# Altium schematic sheet MIDI.SchDoc
size A4; SheetNumber: 2; SheetTotal: 3
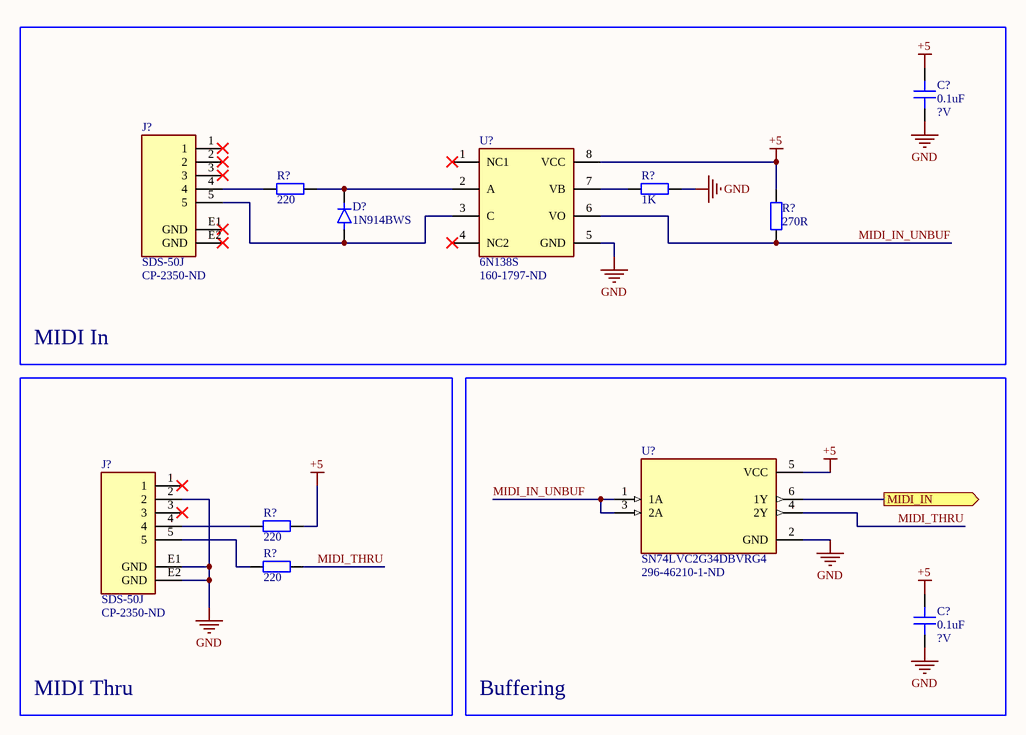
[diagram p0: MIDI.SchDoc]

## Parts
(Parts that share a designator on the sheet are numbered #1, #2 ... from top to bottom, then left to right.)
C?#1  value 0.1uF  Voltage: ?V  [CAP 0402/1005]  (hidden comment: Capacitor_SMD)
C?#2  value 0.1uF  Voltage: ?V  [CAP 0402/1005]  (hidden comment: Capacitor_SMD)
D?  1N914BWS  [DIO_1N914BWS_RR]
J?#1  SDS-50J  Supplier Part Number 1: CP-2350-ND  [CUI_SDS-50J]
J?#2  SDS-50J  Supplier Part Number 1: CP-2350-ND  [CUI_SDS-50J]
R?#1  value 220  [RES 0805/2012]  (hidden comment: Resistor_SMD)
R?#2  value 1K  [RES 0805/2012]  (hidden comment: Resistor_SMD)
R?#3  value 270R  [RES 0805/2012]  (hidden comment: Resistor_SMD)
R?#4  value 220  [RES 0805/2012]  (hidden comment: Resistor_SMD)
R?#5  value 220  [RES 0805/2012]  (hidden comment: Resistor_SMD)
U?#1  6N138S  Supplier Part Number 1: 160-1797-ND  [SMDIP8]
U?#2  SN74LVC2G34DBVRG4  Supplier Part Number 1: 296-46210-1-ND  [SOT95P280X145-6N]

## Blocks framed on the sheet
MIDI In: C?#1 D? J?#1 R?#1-R?#3 U?#1
MIDI Thru: J?#2 R?#4 R?#5
Buffering: C?#2 U?#2

## Ports
MIDI_IN (out)

## Nets
+5: C?#1.1 C?#2.1 R?#3.1 R?#4.1 U?#1.8(VCC) U?#2.5(VCC)
GND: C?#1.2 C?#2.2 J?#2.2 J?#2.E1(GND) J?#2.E2(GND) R?#2.1 U?#1.5(GND) U?#2.2(GND)
MIDI_IN: U?#2.6(1Y) ; port MIDI_IN
MIDI_IN_UNBUF: R?#3.2 U?#1.6(VO) U?#2.1(1A) U?#2.3(2A)
MIDI_THRU: R?#5.1 U?#2.4(2Y)
NetD?_A: D?.A J?#1.5 U?#1.3(C)
NetD?_C: D?.C(K) R?#1.1 U?#1.2(A)
NetJ?#1_4: J?#1.4 R?#1.2
NetJ?#2_4: J?#2.4 R?#4.2
NetJ?#2_5: J?#2.5 R?#5.2
NetR?#2_2: R?#2.2 U?#1.7(VB)

Not connected (* = marked no-connect by the designer): J?#1 1* 2* 3* E1(GND)* E2(GND)*; J?#2 1* 3*; U?#1 1(NC1)* 4(NC2)*

## Library data of the parts
C?#1 C?#2 = Capacitor_SMD: SMD Capacitor
D? = 1N914BWS: SOD-323F, 100V, 0.15A, Switching Diode & Array; MP: 1N914BWS RR; MF: Taiwan Semiconductor; Value: *; Check_prices: https://www.snapeda.com/parts/1N914BWS%20RR/Taiwan+Semiconductor/view-part/?ref=eda; Availability: In Stock; Price: None; Package: SOD-323F Taiwan Semiconductor; SnapEDA_Link: https://www.snapeda.com/parts/1N914BWS%20RR/Taiwan+Semiconductor/view-part/?ref=snap; Purchase-URL: https://pricing.snapeda.com/search/part/1N914BWS RR/?ref=eda
J?#1 J?#2 = SDS-50J: 5 Positions, Receptacle, Right Angle, Through Hole, Standard Circular DIN Connector; Value: *; MP: SDS-50J; Package: None; Availability: Unavailable; Price: None; Supplier 1: Digi-Key
R?#1-R?#5 = Resistor_SMD: SMD Resistor; Power: 100mW
U?#1 = 6N138S: Optoisolator Darlington with Base Output 5000Vrms 1 Channel 8-SMD; MF: ON Semiconductor; MP: 6N138S; SnapEDA_Link: https://www.snapeda.com/parts/6N138S/Onsemi/view-part/560668/?ref=snap; Check_prices: https://www.snapeda.com/parts/6N138S/Onsemi/view-part/560668/?ref=eda; Price: None; Availability: In Stock; Purchase-URL: https://pricing.snapeda.com/search/part/6N138S/?ref=eda; Package: SMD-8 ON Semiconductor; Value: *; Supplier 1: Digi-Key
U?#2 = SN74LVC2G34DBVRG4: Dual Buffer Gate 6-SOT-23 -40 to 125; MF: Texas Instruments; Value: *; Check_prices: https://www.snapeda.com/parts/SN74LVC2G34DBVRG4/Texas+Instruments/view-part/?ref=eda; Digi-Key_Part_Number: 296-46210-1-ND; Package: SOT-23-6 Texas Instruments; Purchase-URL: https://pricing.snapeda.com/search/part/SN74LVC2G34DBVRG4/?ref=eda; SnapEDA_Link: https://www.snapeda.com/parts/SN74LVC2G34DBVRG4/Texas+Instruments/view-part/?ref=snap; MP: SN74LVC2G34DBVRG4; Supplier 1: Digi-Key